# Altium schematic sheet 3-Display.SchDoc
size A4
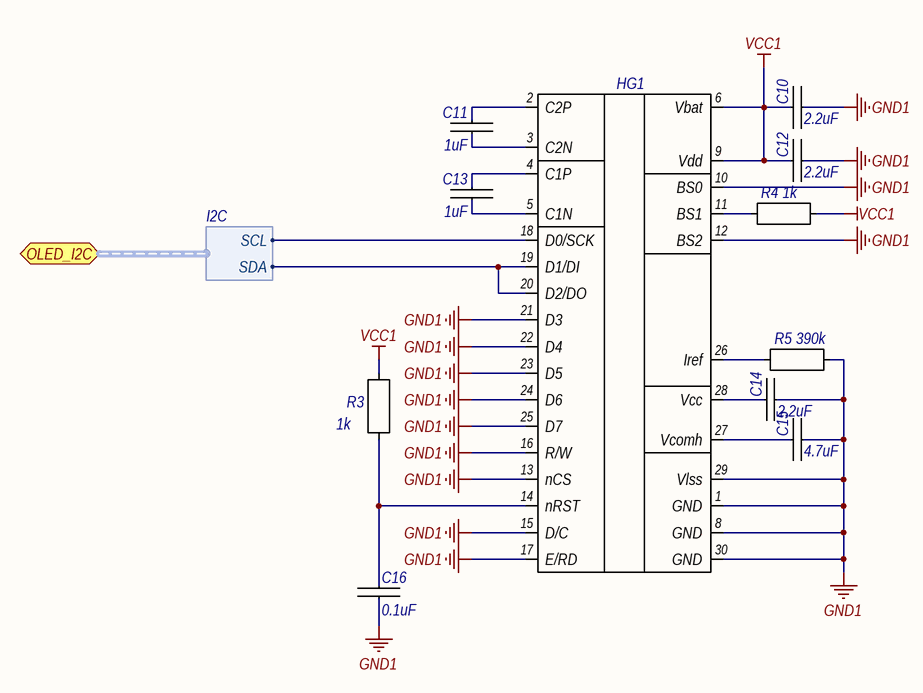
[diagram p0: 3-Display.SchDoc]

## Parts
C10  value 2.2uF  [CHIP_0402_C]  (hidden comment: Конденсатор)
C11  value 1uF  [CHIP_0402_C]  (hidden comment: Конденсатор)
C12  value 2.2uF  [CHIP_0402_C]  (hidden comment: Конденсатор)
C13  value 1uF  [CHIP_0402_C]  (hidden comment: Конденсатор)
C14  value 2.2uF  [CHIP_0402_C]  (hidden comment: Конденсатор)
C15  value 4.7uF  [CHIP_0402_C]  (hidden comment: Конденсатор)
C16  value 0.1uF  [CHIP_0402_C]  (hidden comment: Конденсатор)
HG1  OLED 0,96  [OLED 0.96]  (value not drawn)
R3  value 1k  [CHIP_0402_R]  (hidden comment: Резистор)
R4  value 1k  [CHIP_0402_R]  (hidden comment: Резистор)
R5  value 390k  [CHIP_0402_R]  (hidden comment: Резистор)

## Ports
OLED_I2C (harness I2C)

## Harnesses
I2C: SCL, SDA

## Nets
GND1: C10.1 C12.1 C14.1 C15.1 C16.1 HG1.1(GND) HG1.8(GND) HG1.10(BS0) HG1.12(BS2) HG1.13(nCS) HG1.15(D/C) HG1.16(R/W) HG1.17(E/RD) HG1.21(D3) HG1.22(D4) HG1.23(D5) HG1.24(D6) HG1.25(D7) HG1.29(Vlss) HG1.30(GND) R5.2
VCC1: C10.2 C12.2 HG1.6(Vbat) HG1.9(Vdd) R3.2 R4.2
NetC11_1: C11.1 HG1.3(C2N)
NetC11_2: C11.2 HG1.2(C2P)
NetC13_1: C13.1 HG1.5(C1N)
NetC13_2: C13.2 HG1.4(C1P)
NetC14_2: C14.2 HG1.28(Vcc)
NetC15_2: C15.2 HG1.27(Vcomh)
NetC16_2: C16.2 HG1.14(nRST) R3.1
NetHG1_11: HG1.11(BS1) R4.1
NetHG1_18: HG1.18(D0/SCK) ; port OLED_I2C.SCL
NetHG1_19: HG1.19(D1/DI) HG1.20(D2/DO) ; port OLED_I2C.SDA
NetHG1_26: HG1.26(Iref) R5.1

## Library data of the parts
C10 C12 C14 = Конденсатор: PartNumber: GRM155R61A225KE95D; Mfg: MURATA
C11 C13 = Конденсатор: PartNumber: CC0402KRX5R5BB105; Mfg: YAGEO
C15 = Конденсатор: PartNumber: GRM155R60J475ME87D; Mfg: MURATA
C16 = Конденсатор: PartNumber: CC0402KRX7R7BB104; Mfg: YAGEO
HG1 = OLED 0,96: OLED, Serial, 0.96"; PartNumber: SSD1306 OLED Module; Mfg: *
R3 R4 = Резистор: PartNumber: RC0402FR-071KL; Mfg: YAGEO
R5 = Резистор: PartNumber: RC0402FR-07390KL; Mfg: YAGEO